# Altium schematic sheet USB Connector.SchDoc: USB Type C Connector
size 393 x 292 mm; DocumentNumber: 29; SheetNumber: 17; SheetTotal: 28
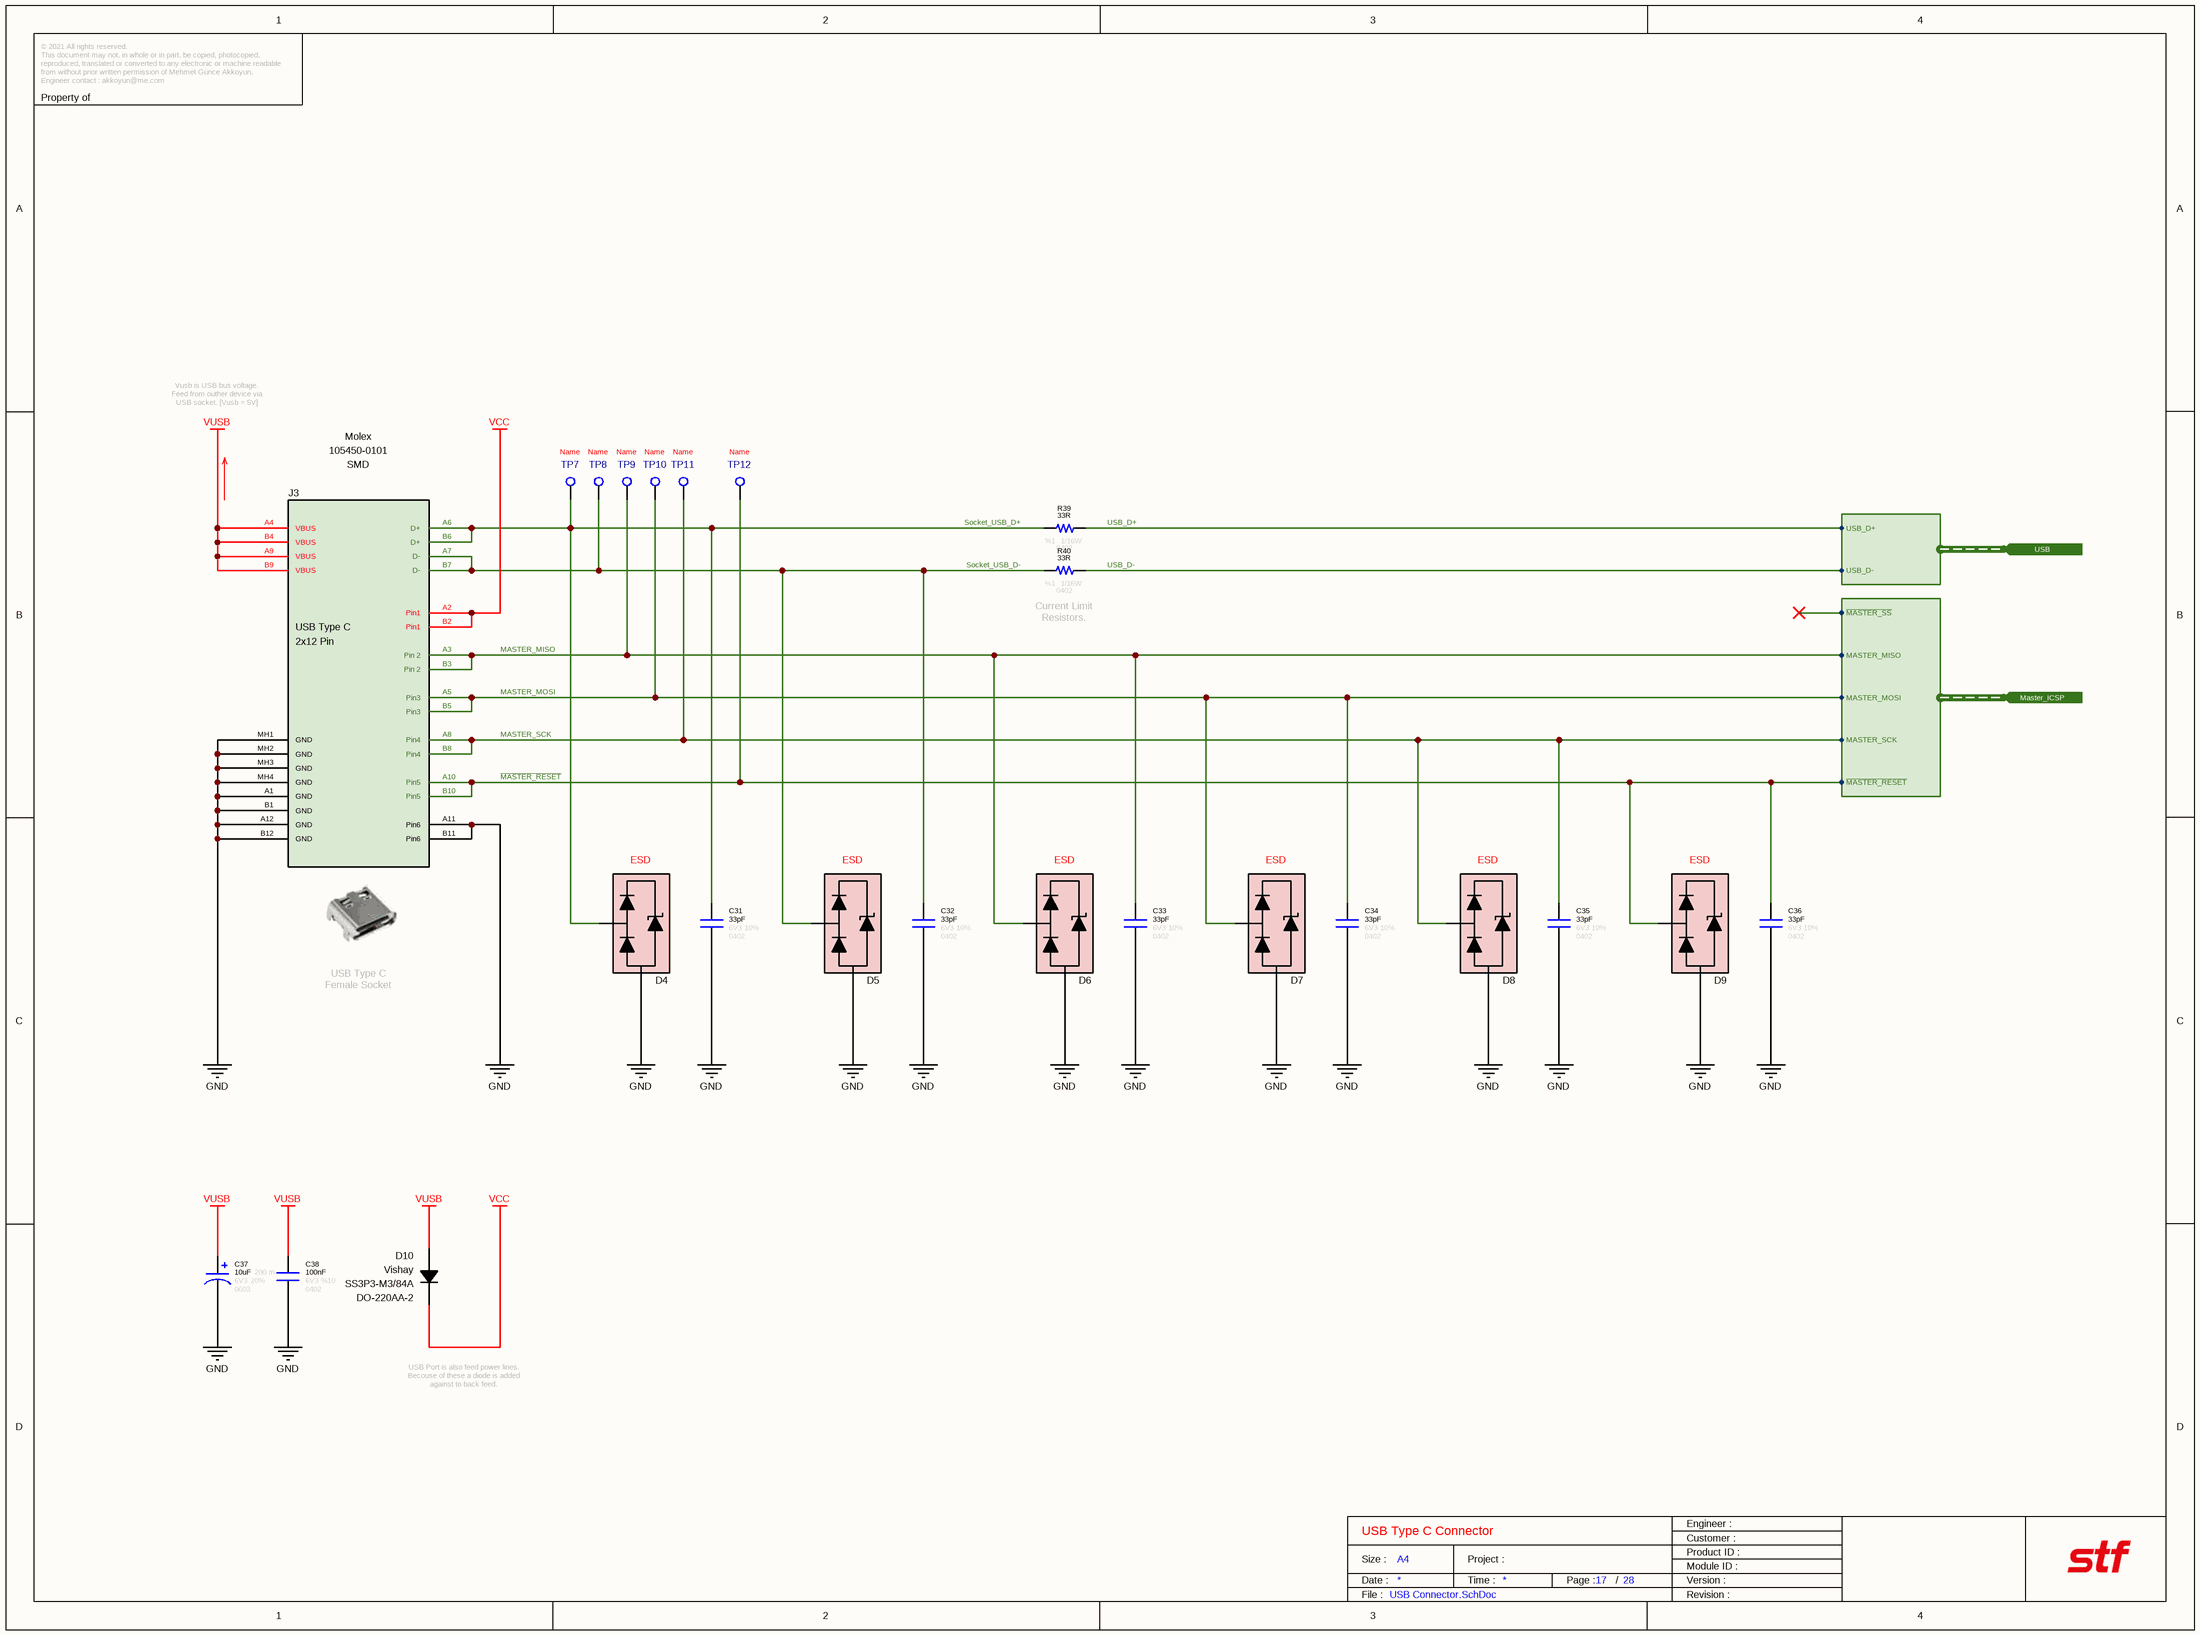
[diagram p0: USB Connector.SchDoc]

## Parts
C31  value 33pF  Tolerance: 10%  Case: 0402  Voltage: 6V3  [CAPACITOR_0402]  (hidden comment: Capacitor - 33pF [0402] (Ceramic))
C32  value 33pF  Tolerance: 10%  Case: 0402  Voltage: 6V3  [CAPACITOR_0402]  (hidden comment: Capacitor - 33pF [0402] (Ceramic))
C33  value 33pF  Tolerance: 10%  Case: 0402  Voltage: 6V3  [CAPACITOR_0402]  (hidden comment: Capacitor - 33pF [0402] (Ceramic))
C34  value 33pF  Tolerance: 10%  Case: 0402  Voltage: 6V3  [CAPACITOR_0402]  (hidden comment: Capacitor - 33pF [0402] (Ceramic))
C35  value 33pF  Tolerance: 10%  Case: 0402  Voltage: 6V3  [CAPACITOR_0402]  (hidden comment: Capacitor - 33pF [0402] (Ceramic))
C36  value 33pF  Tolerance: 10%  Case: 0402  Voltage: 6V3  [CAPACITOR_0402]  (hidden comment: Capacitor - 33pF [0402] (Ceramic))
C37  value 10uF  ESR: 200 m  Tolerance: 20%  Case: 0603  Voltage: 6V3  [CAPACITOR_0603_Tantalum]  (hidden comment: Capacitor - 10uF [0603] (Tantalum))
C38  value 100nF  Tolerance: %10  Voltage: 6V3  Case: 0402  [CAPACITOR_0402]  (hidden comment: Capacitor - 100nF [0402] (Ceramic))
D4  0402ESDA-MLP1  [ESD_0402]  (value not drawn)
D5  0402ESDA-MLP1  [ESD_0402]  (value not drawn)
D6  0402ESDA-MLP1  [ESD_0402]  (value not drawn)
D7  0402ESDA-MLP1  [ESD_0402]  (value not drawn)
D8  0402ESDA-MLP1  [ESD_0402]  (value not drawn)
D9  0402ESDA-MLP1  [ESD_0402]  (value not drawn)
D10  Manufacturer Name: Vishay  [DO-220AA-2]  (hidden comment: SS3P3-M3/84A)
J3  Manufacturer Name: Molex  Case: SMD  [USB Type C - Molex 105450-0101]  (hidden comment: 105450-0101)
R39  value 33R  Case: 0402  Tolerance: %1  Power: 1/16W  [RESISTOR_0402]  (hidden comment: 33R - 0402 - %1 - 1/16W)
R40  value 33R  Case: 0402  Tolerance: %1  Power: 1/16W  [RESISTOR_0402]  (hidden comment: 33R - 0402 - %1 - 1/16W)
TP7  PCB - Test Point  [Test_Point]  (value not drawn)  (no BOM)
TP8  PCB - Test Point  [Test_Point]  (value not drawn)  (no BOM)
TP9  PCB - Test Point  [Test_Point]  (value not drawn)  (no BOM)
TP10  PCB - Test Point  [Test_Point]  (value not drawn)  (no BOM)
TP11  PCB - Test Point  [Test_Point]  (value not drawn)  (no BOM)
TP12  PCB - Test Point  [Test_Point]  (value not drawn)  (no BOM)

## Ports
Master_ICSP (in, harness Master_ICSP), USB (in, harness USB)

## Harnesses
Master_ICSP: MASTER_MOSI, MASTER_MISO, MASTER_SCK, ~{MASTER_RESET}, ~{MASTER_SS}
USB: USB_D+, USB_D-

## Nets
GND: C31.1 C32.1 C33.1 C34.1 C35.1 C36.1 C37.2 C38.1 D4.2(GND) D5.2(GND) D6.2(GND) D7.2(GND) D8.2(GND) D9.2(GND) J3.A1(GND) J3.A11(Pin6) J3.A12(GND) J3.B1(GND) J3.B11(Pin6) J3.B12(GND) J3.MH1(GND) J3.MH2(GND) J3.MH3(GND) J3.MH4(GND)
VCC: D10.2(Cathode) J3.A2(Pin1) J3.B2(Pin1)
VUSB: C37.1 C38.2 D10.1(Anode) J3.A4(VBUS) J3.A9(VBUS) J3.B4(VBUS) J3.B9(VBUS)
~{MASTER_RESET}: C36.2 D9.1(I/O) J3.A10(Pin5) J3.B10(Pin5) TP12.1 ; port Master_ICSP.~{MASTER_RESET}
MASTER_MISO: C33.2 D6.1(I/O) J3.A3(Pin_2) J3.B3(Pin_2) TP9.1 ; port Master_ICSP.MASTER_MISO
MASTER_MOSI: C34.2 D7.1(I/O) J3.A5(Pin3) J3.B5(Pin3) TP10.1 ; port Master_ICSP.MASTER_MOSI
MASTER_SCK: C35.2 D8.1(I/O) J3.A8(Pin4) J3.B8(Pin4) TP11.1 ; port Master_ICSP.MASTER_SCK
Socket_USB_D+: C31.2 D4.1(I/O) J3.A6(D+) J3.B6(D+) R39.2 TP7.1
Socket_USB_D-: C32.2 D5.1(I/O) J3.A7(D-) J3.B7(D-) R40.2 TP8.1
USB_D+: R39.1 ; port USB.USB_D+
USB_D-: R40.1 ; port USB.USB_D-

## Notes on the sheet
- Vusb is USB bus voltage. Feed from outher device via USB socket. [Vusb = 5V]
- (near R40) Current Limit Resistors.
- USB Type C
  Female Socket
- USB Port is also feed power lines. Becouse of these a diode is added against to back feed.
- © 2021 All rights reserved.
  This document may not, in whole or in part, be copied, photocopied, reproduced, translated or converted to any electronic or machine readable from without prior written permission of Mehmet Günce Akkoyun.
  Engineer contact : akkoyun@me.com
- Property of
- Engineer :
- Date :
- Size :
- A4
- Time :
- Project :
- Page :
- /
- Customer :
- Product ID :
- Module ID :
- Version :
- File :
- Revision :
- (in symbol Connector - USB Type C SMD Connector) USB Type C; 2x12 Pin
- (in symbol Diode - TPD1E05U06DPYR) ESD

## Library data of the parts
C31-C36 = Capacitor - 33pF [0402-6V3]: Manufacturer Name: Kemet; Manufacturer Part Number: C0402C330J9RACAUTO; ComponentLink1Description: DataSheet; ComponentLink1URL: https://api.kemet.com/component-edge/download/datasheet/C0402C330J9RACAUTO.pdf; ComponentLink2Description: Mouser; ComponentLink2URL: https://www.mouser.com/Search/Refine.aspx?Keyword=80-C0402C330J9RAUTO
C37 = Capacitor - 10uF [0603-6V3] (Tantalium): Capacitor - 10uF [0603] (Tantalium); Manufacturer Name: AVX; Manufacturer Part Number: F380J106MMAAH3; ComponentLink1Description: DataSheet; ComponentLink1URL: https://www.mouser.com.tr/datasheet/2/40/f38-775706.pdf; ComponentLink2Description: Mouser; ComponentLink2URL: https://www.mouser.com.tr/ProductDetail/AVX/F380J106MMAAH3?qs=sGAEpiMZZMtZ1n0r9vR22fixilZl6Mr8zRKleESmvcDFwZ4LSyC6Pg%3D%3D
C38 = Capacitor - 100nF [0402-6V3]: Capacitor - 100nF [0402-6V3] (Ceramic); Manufacturer Name: AVX; Manufacturer Part Number: 04026D104KAT4A; ComponentLink1Description: Mouser; ComponentLink1URL: https://www.mouser.com.tr/ProductDetail/AVX/04026D104KAT4A?qs=sGAEpiMZZMs0AnBnWHyRQPg4iYkCw7IMED%2F4kpqgf7w%3D; ComponentLink2Description: DataSheet; ComponentLink2URL: https://www.mouser.com.tr/datasheet/2/40/cx5r-776519.pdf
D4-D9 = Diode - TPD1E05U06DPYR: SUPPRESSOR ESD 30VDC 0402 HFREE; Manufacturer Name: Eaton; Breakdown Voltage: 30V; Capacitance: 0.15pF; Manufacturer Part Number: 0402ESDA-MLP1; Case: 0402
D10 = Diode - SS3P3M384A: Schottky Diodes & Rectifiers 3.0 Amp 30 Volt 50 Amp IFSM; Forward Current: 3 A; Forward Voltage: 580 mV; Maximum Operating Temperature: + 150 C; Minimum Operating Temperature: - 55 C; Product Type: Schottky Diodes & Rectifiers; RoHS: Yes; Manufacturer Part Number: SS3P3-M3/84A; Case: DO-220AA-2
J3 = Connector - USB Type C SMD Connector: USB Shielded I/O Receptacle; Type C; Right Angle; Surface Mount; Gold over Nickel; Current Rating: 5 A.; Gender: Jack (Female); Number of Contacts: 24 Contact; Voltage Rating: 30 V; Maximum Operating Temperature: + 85 C; Minimum Operating Temperature: - 30 C; Mounting Angle: Right Angle; Product Type: USB Connectors; RoHS: Yes; Manufacturer Part Number: 105450-0101
R39 R40 = Resistor - 33R [0402]: Thick Film Resistors - SMD 1/16 W 33 Ohm 1%; Manufacturer Name: Vishay; Manufacturer Part Number: CRCW040233R0FKED; ComponentLink1Description: DataSheet; ComponentLink1URL: https://www.mouser.com.tr/datasheet/2/427/dcrcwe3-1762152.pdf; ComponentLink2Description: Mouser; ComponentLink2URL: https://www.mouser.com.tr/ProductDetail/Vishay-Dale/CRCW0402330RFKED?qs=sGAEpiMZZMu61qfTUdNhG2DpbjADlD3GGS6SwBlLi5Q%3D
TP7-TP12 = PCB - Test Point: Test Point; Name: Name